# Altium schematic sheet Interface.SchDoc
size A4
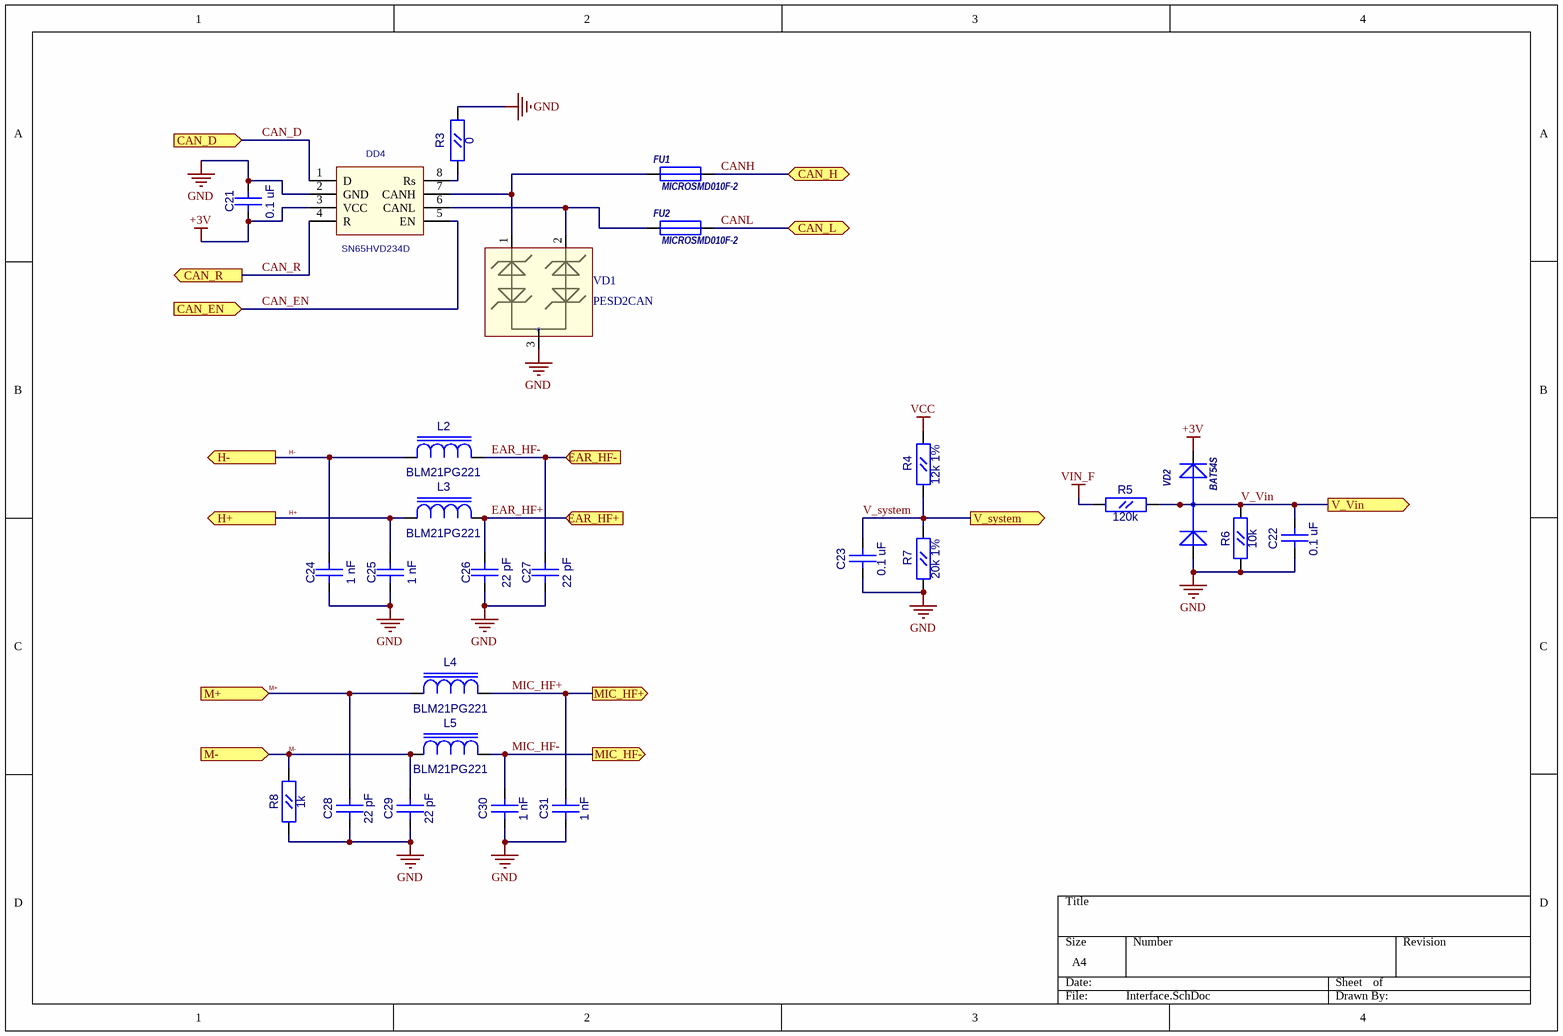
[diagram p0: Interface.SchDoc]

## Parts
C21  0.1 uF  [CC0603]
C22  0.1 uF  [CC0603]
C23  0.1 uF  [CC0603]
C24  1 nF  [CC0603]
C25  1 nF  [CC0603]
C26  22 pF  [CC0603]
C27  22 pF  [CC0603]
C28  22 pF  [CC0603]
C29  22 pF  [CC0603]
C30  1 nF  [CC0603]
C31  1 nF  [CC0603]
DD4  SN65HVD234D  [SO-8]
FU1  MICROSMD010F-2  [RC1210]
FU2  MICROSMD010F-2  [RC1210]
L2  BLM21PG221  [RC0805]
L3  BLM21PG221  [RC0805]
L4  BLM21PG221  [RC0805]
L5  BLM21PG221  [RC0805]
R3  0  [RC0603]
R4  12k 1%  [RC0603]
R5  120k  [RC0603]
R6  10k  [RC0603]
R7  20k 1%  [RC0603]
R8  1k  [RC0603]
VD1  PESD2CAN  [SOT-23(123)]
VD2  BAT54S  [SOT-23(GSD)]

## Ports
CAN_D (in), CAN_EN (in), CAN_H (bidir), CAN_L (bidir), CAN_R (out), EAR_HF+ (in), EAR_HF- (in), H+ (out), H- (out), M+ (in), M- (in), MIC_HF+ (out), MIC_HF- (out), V_system (out), V_Vin (out)

## Nets
+3V: C21.1(A) DD4.3(VCC) VD2.2(K)
GND: C21.2(B) C22.2(B) C23.2(B) C24.1(A) C25.1(A) C26.1(A) C27.1(A) C28.1(A) C29.1(A) C30.1(A) C31.1(A) DD4.2(GND) R3.2(B) R6.2(B) R7.1(A) R8.1(A) VD1.3 VD2.1(A)
VCC: R4.2(B)
VIN_F: R5.2(B)
CAN_D: DD4.1(D) ; port CAN_D
CAN_EN: DD4.5(EN) ; port CAN_EN
CAN_R: DD4.4(R) ; port CAN_R
CANH: FU1.2 ; port CAN_H
CANL: FU2.2 ; port CAN_L
EAR_HF+: C26.2(B) L3.1(A) ; port EAR_HF+
EAR_HF-: C27.2(B) L2.1(A) ; port EAR_HF-
H+: C25.2(B) L3.2(B) ; port H+
H-: C24.2(B) L2.2(B) ; port H-
M+: C28.2(B) L4.1(A) ; port M+
M-: C29.2(B) L5.1(A) R8.2(B) ; port M-
MIC_HF+: C31.2(B) L4.2(B) ; port MIC_HF+
MIC_HF-: C30.2(B) L5.2(B) ; port MIC_HF-
V_system: C23.1(A) R4.1(A) R7.2(B) ; port V_system
V_Vin: C22.1(A) R5.1(A) R6.1(A) VD2.3(AK) ; port V_Vin
NetDD4_6: DD4.6(CANL) FU2.1 VD1.2
NetDD4_7: DD4.7(CANH) FU1.1 VD1.1
NetDD4_8: DD4.8(Rs) R3.1(A)

## Library data of the parts
C21-C31 = CC0603
  C21-C23: Value: 0.1 uF
  C24 C25 C30 C31: Value: 1 nF
  C26-C29: Value: 22 pF
DD4 = SN65HVD234D: CAN Transceiver; Value: *
FU1 FU2 = MICROSMD: Value: MICROSMD010F-2
R3-R8 = RC0603
  R3: Value: 0
  R4: Value: 12k 1%
  R5: Value: 120k
  R6: Value: 10k
  R7: Value: 20k 1%
  R8: Value: 1k
VD1 = PESD2CAN: TVS for CAN
VD2 = BAT54S: 1.0 Ampere General Purpose Rectifier; ComponentField6: Published 8-Jun-2000, Modified 11-July-2000: SIM Model Added.; Value: *